# Altium schematic sheet Sheet2.SchDoc
size A3; SheetNumber: 2; SheetTotal: 2
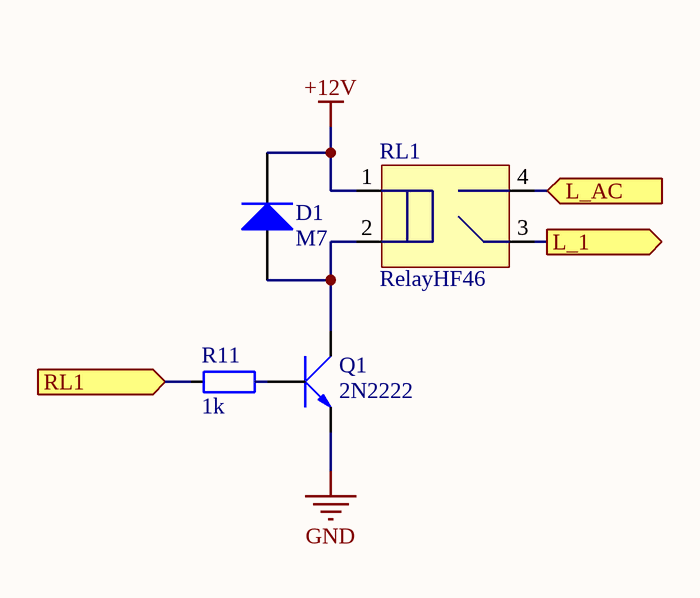
[diagram p0: Sheet2.SchDoc]

## Parts
D1  M7  [DIODE SMA]
Q1  2N2222  [SOT23]
R11  1k  [RES-SMD-0805]
RL1  RelayHF46  [Relay 4 chan HF46F]

## Ports
L_1 (out), L_AC (in), RL1 (in)

## Nets
+12V: D1.2(K) RL1.1
GND: Q1.2(E)
L_1: RL1.3(AC/DC) ; port L_1
L_AC: RL1.4(AC/DC) ; port L_AC
RL1: R11.1 ; port RL1
NetD1_1: D1.1(A) Q1.3(C) RL1.2
NetQ1_1: Q1.1(B) R11.2

## Library data of the parts
D1 = Diode M7 ( 4007 ): Dán; Don_Vi: Con; Ten_Linh_Kien: Diode M7 1N4007 SMD 1A 1000V; Ma_Hang: MH000944; Chung_Loai: Dán; Ghi_Chu: *
Q1 = C1815 HF SMD: NPN transistor; Value: C9014
R11 = Resistor - SMD: Resistor; Manufacturer: Generic Components; Class: Passive; Published: 08/06/2000; Publisher: Altium Hobart Technology Centre
RL1 = Relay 4 chan HF46F: Ten: Relay 5V5A HF46F-G 5-HS1; Ma_Hang: MH003879